# EAGLE design control-v1 (EAGLE 6.4)
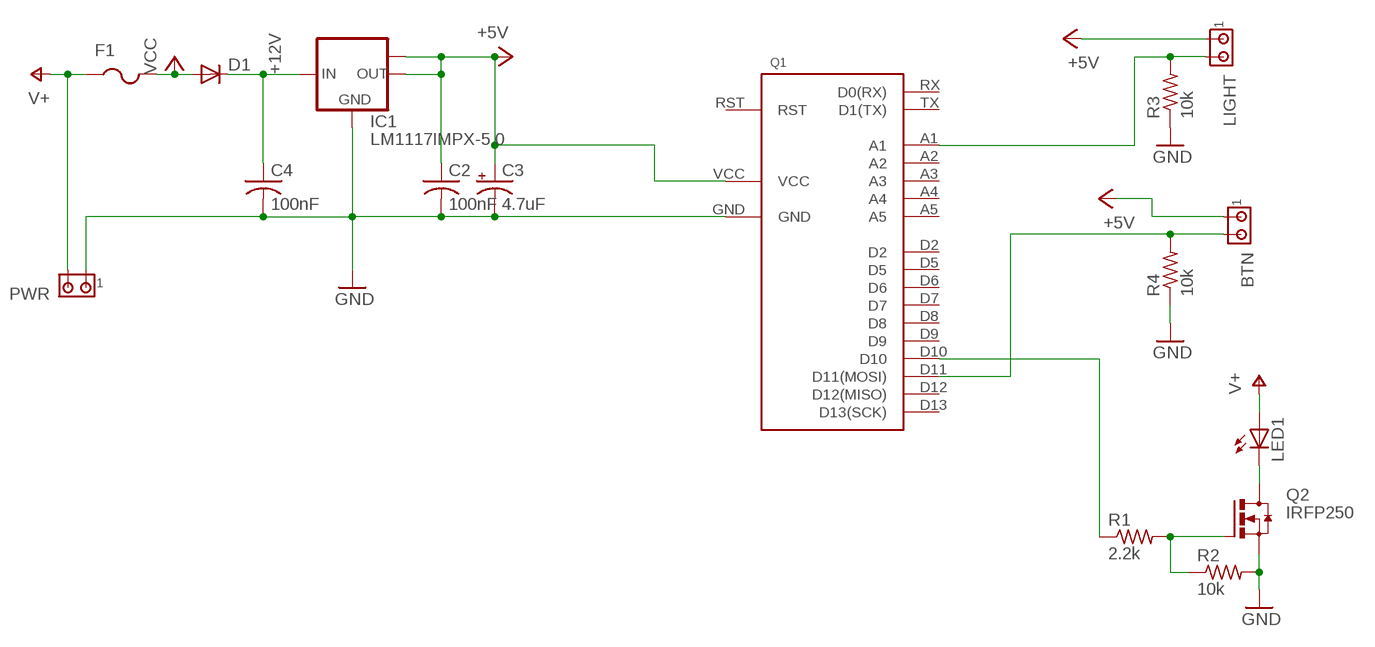
[diagram p0: schematic, sheet 1]

## Parts
BTN  MTA02-100  [10X02MTA]
C2  100nF  C-USC0603K  [C0603K]
C3  4.7uF  CPOL-USE1.8-4  [E1,8-4]
C4  100nF  C-USC0603K  [C0603K]
D1  DIODE-MICROMELF-W  [MICROMELF-W]
F1  PTCFUSE-1812  [1812]
IC1  LM1117IMPX-5.0  [SOT223]
LED1  LED3MM  [LED3MM]
LIGHT  MTA02-100  [10X02MTA]
PWR  MTA02-100  [10X02MTA]
Q1  HOME-CPU-V1  [HOME-CPU-V1]
Q2  IRFP250  [TO-247AD-V]
R1  2.2k  R-US_R0603  [R0603]
R2  10k  R-US_R0603  [R0603]
R3  10k  R-US_R0603  [R0603]
R4  10k  R-US_R0603  [R0603]

## Nets
+12V: C4.1 D1.C IC1.3(IN)
GND: C2.2 C3.- C4.2 IC1.1(GND) PWR.1 Q1.GND Q2.S R2.2 R3.1 R4.1
N$1: D1.A F1.2 ; supply symbol labelled VCC
N$2: LED1.K(C) Q2.D
N$3: Q1.D10 R1.1
N$4: Q2.G R1.2 R2.1
N$5: LIGHT.2 Q1.A1 R3.2
N$7: BTN.2 Q1.D11(D11(MOSI)) R4.2
V+: F1.1 LED1.A PWR.2
VCC: BTN.1 C2.1 C3.+ IC1.2(OUT) IC1.TAB(OUT1) LIGHT.1 Q1.VCC ; supply symbol labelled +5V
Unconnected: Q1.A2 Q1.A3 Q1.A4 Q1.A5 Q1.D2 Q1.D5 Q1.D6 Q1.D7 Q1.D8 Q1.D9 Q1.D12(D12(MISO)) Q1.D13(D13(SCK)) Q1.RST Q1.RX(D0(RX)) Q1.TX(D1(TX))

## Library data of the parts
BTN LIGHT PWR = con-amp:MTA02-100: AMP connector
C2 C4 = adafruit:C-US: CAPACITOR, American symbol
C3 = adafruit:CPOL-US: POLARIZED CAPACITOR, American symbol
D1 = diode:DIODE-: DIODE
F1 = adafruit:PTCFUSE: PTC fuses, resettable thermistors
IC1 = lm1117:LM1117IMPX-*
LED1 = adafruit:LED: LED OSRAM: - CHIPLED LG R971, LG N971, LY N971, LG Q971, LY Q971, LO R971, LY R971 LH N974, LH R974 LS Q976, LO Q976, LY Q976 LO Q996 - Hyper CHIPLED LW Q18S LB Q993, LB Q99A, LB R99A - SideLED LS A670, LO A670, LY A670, LG A670, LP A670 LB A673, LV A673, LT A673, LW A673 LH A674 LY A675 LS A676, LA A676, LO A676, LY A676, LW A676 LS A679, LY A679, LG A679 - Hyper Micro SIDELED® LS Y876, LA Y876, LO Y876, LY Y876 LT Y87S - SmartLED LW L88C, LW L88S LB L89C, LB L89S, LG L890 LS L89K, LO L89K, LY L89K LS L896, LA L896, LO L896, LY L896 - TOPLED LS T670, LO T670, LY T670, LG T670, LP T670 LSG T670, LSP T670, LSY T670, LOP T670, LYG T670 LG T671, LOG T671, LSG T671 LB T673, LV T673, LT T673, LW T673 LH T674 LS T676, LA T676, LO T676, LY T676, LB T676, LH T676, LSB T676, LW T676 LB T67C, LV T67C, LT T67C, LS T67K, LO T67K, LY T67K, LW E67C LS E67B, LA E67B, LO E67B, LY E67B, LB E67C, LV E67C, LT E67C LW T67C LS T679, LY T679, LG T679 LS T770, LO T770, LY T770, LG T770, LP T770 LB T773, LV T773, LT T773, LW T773 LH T774 LS E675, LA E675, LY E675, LS T675 LS T776, LA T776, LO T776, LY T776, LB T776 LHGB T686 LT T68C, LB T68C - Hyper Mini TOPLED® LB M676 - Mini TOPLED Santana® LG M470 LS M47K, LO M47K, LY M47K Source: http://www.osram.convergy.de/
Q1 = serge:HOME-CPU-V1
Q2 = transistor-power:IRFP25*: 33A/27A, 200V/150V, 0.085/0.012 Ohm, N-Channel Power MOSFET Source: Fairchild Semiconductor Corporation
R1-R4 = adafruit:R-US_: RESISTOR, American symbol

## Board
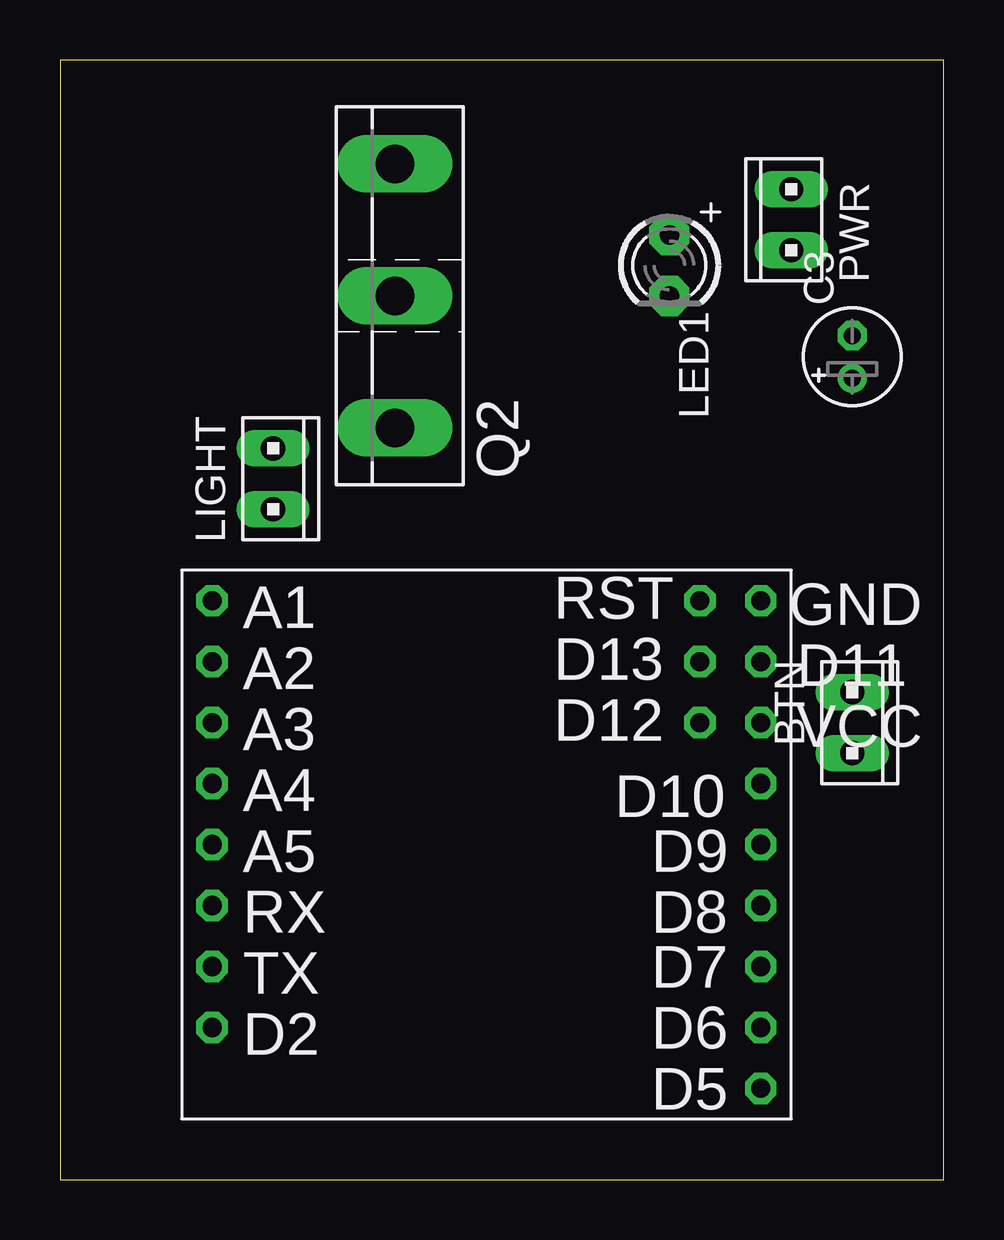
[diagram p1: board, top side]
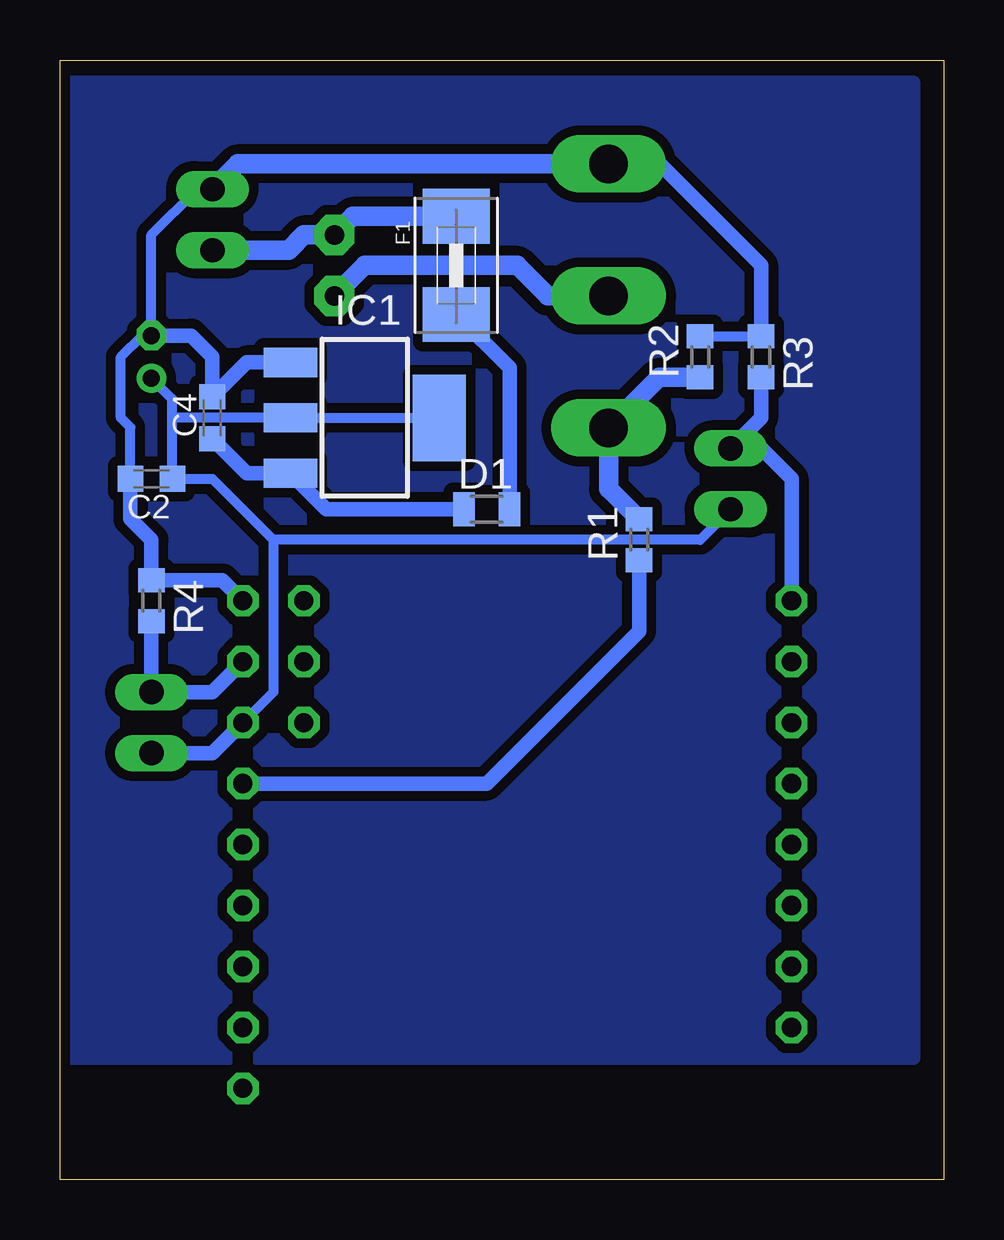
[diagram p2: board, bottom side, seen from below]

Size 36.82 x 46.66 mm. Coordinates in mm from the lower left corner, seen from the top.
Outline: 36.82,0 36.82,46.66 0,46.66 0,0 36.82,0
Copper layers (1*16): Top 0.035mm / dielectric 1.5mm / Bottom 0.035mm
Design rules "default": minimum track width 10mil, minimum drill 24mil, track to track 16mil, track to pad 16mil, pad to pad 16mil, via to via 16mil, smd to smd 16mil, copper to edge 16mil, drill to drill 8mil, minimum pad ring 10mil, minimum via ring 8mil, stop-mask expansion 4mil, vias tented up to drill 0mil, thermal gap 10mil

### Footprints (pad centres in the part's own frame; a part is rotated, then mirrored left to right if it is on the bottom)
10X02MTA = drill 1.016 long: 1 1.27,0; 2 -1.27,0
C0603K = smd 1.05 x 1.08: 1 -0.875,0; 2 0.875,0
E1,8-4 = drill 0.711 pad 1.168: + -0.889,0 | drill 0.711 pad 1.168 octagon: - 0.889,0
MICROMELF-W = smd 0.9 x 1.4: A 0.95,0; C -0.95,0
1812 = smd 2.286 x 2.794: 1 -2.046,0; 2 2.046,0
SOT223 = smd 1.219 x 2.235: 1 -2.311,-3.099; 2 0,-3.099; 3 2.311,-3.099 | smd 3.6 x 2.2: TAB 0,3.099
LED3MM = drill 0.813 pad 1.676 octagon: A -1.27,0; K 1.27,0
HOME-CPU-V1 = drill 0.8 octagon: A1 5.08,22.86; A2 2.54,22.86; A3 0,22.86; A4 -2.54,22.86; A5 -5.08,22.86; D2 -12.7,22.86; D5 -15.24,0; D6 -12.7,0; D7 -10.16,0; D8 -7.62,0; D9 -5.08,0; D10 -2.54,0; D11 2.54,0; D12 0,2.54; D13 2.54,2.54; GND 5.08,0; RST 5.08,2.54; RX -7.62,22.86; TX -10.16,22.86; VCC 0,0
TO-247AD-V = drill 1.6 long: D 0,-2.54; G -5.5,-2.54; S 5.5,-2.54
R0603 = smd 1 x 1.1: 1 -0.85,0; 2 0.85,0

### Placement (x,y rotation side)
BTN  33.01,19.05 270 top
C2  33.01,29.21 180 bottom
C3  33.01,34.29 90 top
C4  30.47,31.75 90 bottom
D1  19.04,27.94 0 bottom
F1  20.31,38.1 270 bottom
IC1  24.12,31.75 270 bottom
LED1  25.39,38.1 270 top
LIGHT  8.88,29.21 270 top
PWR  30.47,40.01 90 top
Q1  29.2,19.05 90 top
Q2  11.42,36.83 90 top
R1  12.69,26.67 90 bottom
R2  10.15,34.29 90 bottom
R3  7.61,34.29 270 bottom
R4  33.01,24.13 270 bottom

### Tracks (layer width: path | path; a pad name or v marks a point on that pad's centre or on a via)
+12V
  Bottom 0.406: IC1.3 27.76,29.44
  Bottom 0.61: D1.C 25.72,27.94 IC1.3 | 27.76,29.44 29.03,29.44 C4.1
GND
  Bottom 0.406: R2.2 R3.1 | PWR.1 31.1,41.27 33.01,39.37 C3.- 33.39,35.18 34.28,34.29 34.28,31.75 33.89,31.36 C2.2 | IC1.1 26.89,34.06
  Bottom 0.61: Q2.S 11.84,42.33 7.61,38.1 R3.1 | Q1.GND 30.05,24.98 R4.1 33.01,26.67 33.89,27.55 C2.2 | C3.- 31.36,35.18 30.47,34.29 C4.2 29.03,34.06 26.89,34.06
  Bottom 0.813: Q2.S 29.41,42.33 PWR.1
N$1
  Bottom 0.61: D1.A 18.09,33.83 F1.2
N$2
  Bottom 0.813: Q2.D 16.5,36.83 17.77,38.1 24.12,38.1 LED1.K
N$3
  Bottom 0.61: Q1.D10 19.04,16.51 12.69,22.86 R1.1
N$4
  Bottom 0.813: R1.2 13.96,28.79 Q2.G 11.85,33.44 R2.1
N$5
  Bottom 0.61: Q1.A1 6.34,29.21 7.61,30.48 LIGHT.2 7.61,31.75 R3.2
N$7
  Bottom 0.61: Q1.D11 30.47,20.32 BTN.2 R4.2
SOMETHINGELSE
  pour Bottom: 36.82,5.08 36.82,45.72 1.26,45.72 1.26,5.08
V+
  Bottom 0.813: PWR.2 27.29,38.73 26.66,39.37 LED1.A 24.61,40.15 F1.1
VCC
  Bottom 0.406: 27.93,26.67 30.47,29.21 C2.1 32.14,31.75 | 27.93,26.67 27.93,20.32 Q1.VCC | LIGHT.1 10.15,26.67 27.93,26.67 | IC1.TAB IC1.2 32.14,31.75 | 32.14,31.75 32.14,32.53 C3.+
  Bottom 0.61: BTN.1 30.47,17.78 Q1.VCC